# Altium schematic sheet 03_MotorDriver.SchDoc: Motor Driver
size A3; SheetNumber: 4; SheetTotal: 10
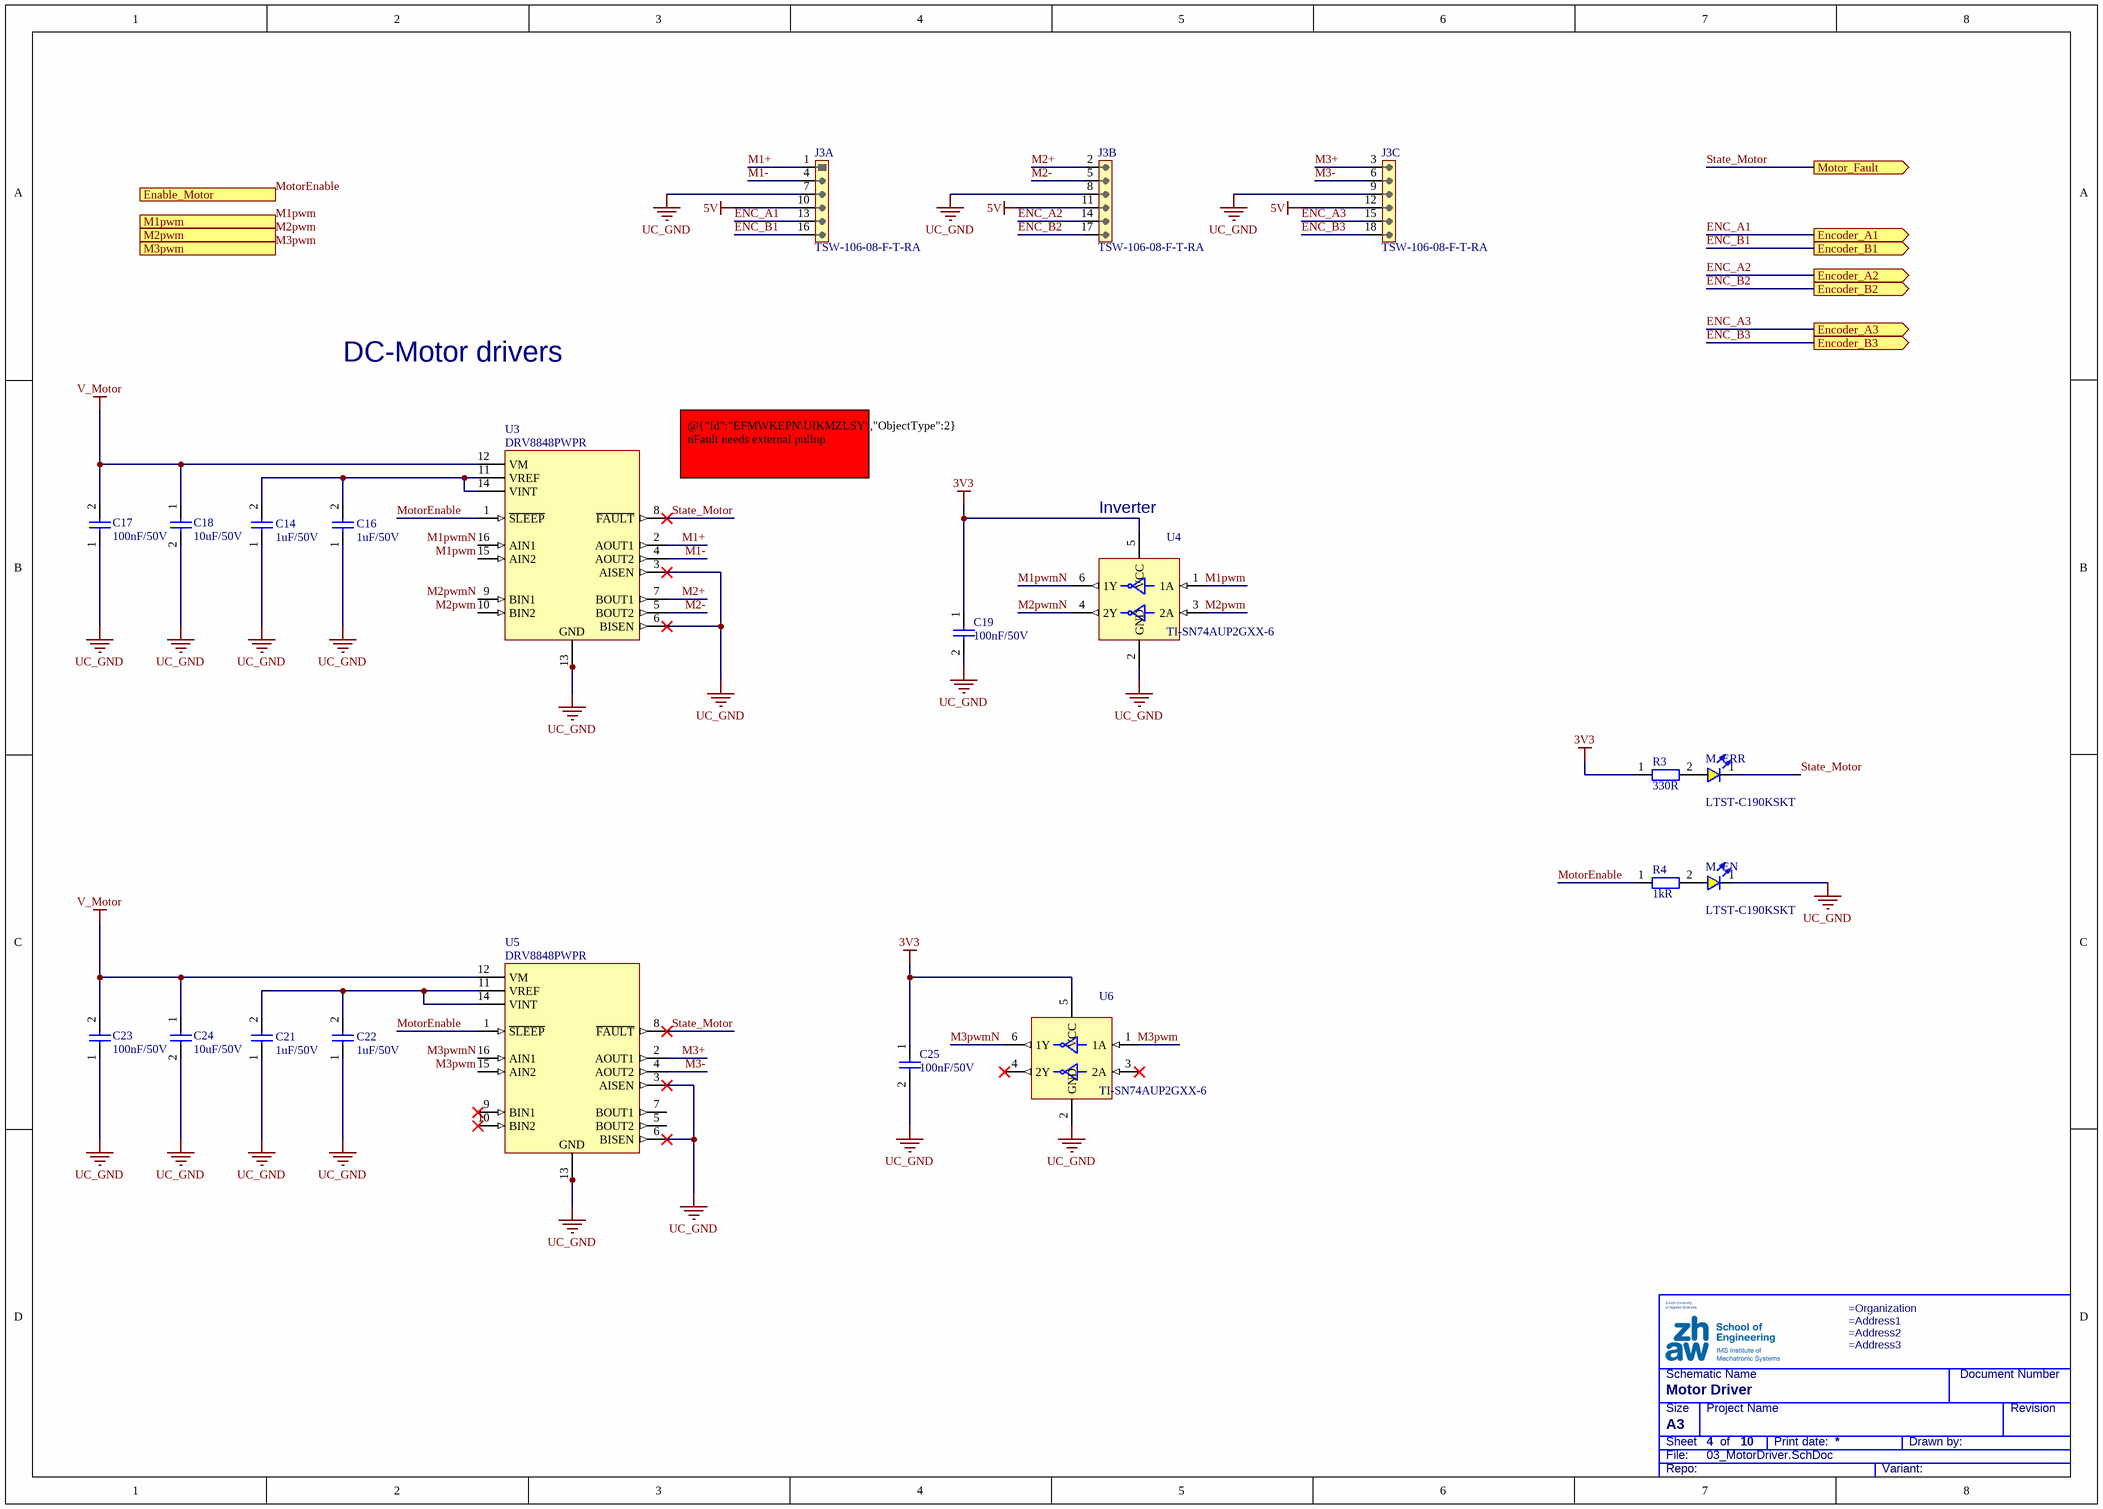
[diagram p0: 03_MotorDriver.SchDoc]

## Parts
C14  1uF/50V  [CAPC1608X09L]
C16  1uF/50V  [CAPC1608X09L]
C17  100nF/50V  [CAPC1005X05L]
C18  10uF/50V  [CAPC3216X12L]
C19  100nF/50V  [CAPC1005X05L]
C21  1uF/50V  [CAPC1608X09L]
C22  1uF/50V  [CAPC1608X09L]
C23  100nF/50V  [CAPC1005X05L]
C24  10uF/50V  [CAPC3216X12L]
C25  100nF/50V  [CAPC1005X05L]
J3  TSW-106-08-F-T-RA  [SAMTEC_TSW-106-08-F-T-RA]  (parts A,B,C of 3)
M._EN  LTST-C190KSKT  [LEDSC160X80X80-2Lye]
M._ERR  LTST-C190KSKT  [LEDSC160X80X80-2Lye]
R3  330R  [RESC1005X04L]
R4  1kR  [RESC1005X04L]
U3  DRV8848PWPR  [TSOP65P640X120-17T277X246L]
U4  TI-SN74AUP2GXX-6  [SOT65P210X110-6L]
U5  DRV8848PWPR  [TSOP65P640X120-17T277X246L]
U6  TI-SN74AUP2GXX-6  [SOT65P210X110-6L]

## Ports
Enable_Motor (in), Encoder_A1 (out), Encoder_A2 (out), Encoder_A3 (out), Encoder_B1 (out), Encoder_B2 (out), Encoder_B3 (out), M1pwm (in), M2pwm (in), M3pwm (in), Motor_Fault (out)

## Nets
3V3: C19.1 C25.1 R3.1 U4.5(VCC) U6.5(VCC)
5V: J3.10 J3.11 J3.12
UC_GND: C14.1 C16.1 C17.1 C18.2 C19.2 C21.1 C22.1 C23.1 C24.2 C25.2 J3.7 J3.8 J3.9 M._EN.1(K) U3.3(AISEN) U3.6(BISEN) U3.13(GND) U3.17(GND) U4.2(GND) U5.3(AISEN) U5.6(BISEN) U5.13(GND) U5.17(GND) U6.2(GND)
V_Motor: C17.2 C18.1 C23.2 C24.1 U3.12(VM) U5.12(VM)
ENC_A1: J3.13 ; port Encoder_A1
ENC_A2: J3.14 ; port Encoder_A2
ENC_A3: J3.15 ; port Encoder_A3
ENC_B1: J3.16 ; port Encoder_B1
ENC_B2: J3.17 ; port Encoder_B2
ENC_B3: J3.18 ; port Encoder_B3
M1+: J3.1 U3.2(AOUT1)
M1-: J3.4 U3.4(AOUT2)
M1pwm: U3.15(AIN2) U4.1(1A) ; port M1pwm
M1pwmN: U3.16(AIN1) U4.6(1Y)
M2+: J3.2 U3.7(BOUT1)
M2-: J3.5 U3.5(BOUT2)
M2pwm: U3.10(BIN2) U4.3(2A) ; port M2pwm
M2pwmN: U3.9(BIN1) U4.4(2Y)
M3+: J3.3 U5.2(AOUT1)
M3-: J3.6 U5.4(AOUT2)
M3pwm: U5.15(AIN2) U6.1(1A) ; port M3pwm
M3pwmN: U5.16(AIN1) U6.6(1Y)
MotorEnable: R4.1 U3.1(~{SLEEP}) U5.1(~{SLEEP}) ; port Enable_Motor
State_Motor: M._ERR.1(K) U3.8(~{FAULT}) U5.8(~{FAULT}) ; port Motor_Fault
NetC14_2: C14.2 C16.2 U3.11(VREF) U3.14(VINT)
NetC21_2: C21.2 C22.2 U5.11(VREF) U5.14(VINT)
NetM._EN_2: M._EN.2(A) R4.2
NetM._ERR_2: M._ERR.2(A) R3.2

Not connected (* = marked no-connect by the designer): U5 5(BOUT2) 7(BOUT1) 9(BIN1)* 10(BIN2)*; U6 3(2A)* 4(2Y)*

## Notes on the sheet
- DC-Motor drivers
- (near U3) @{"Id":"EFMWKEPN\UIKMZLSY","ObjectType":2} nFault needs external pullup
- (near U4) Inverter
- Schematic Name
- Document Number
- File:
- Sheet
- Size
- A3
- Project Name
- of
- Print date:
- Drawn by:
- Revision
- Repo:
- Variant:

## Library data of the parts
C14 C16 C21 C22 = CMP-00006-9: Cap MLCC, 1uF, 50V, X5R, 10%, 0603; Value: 1µF; Case/Package: 0603; Case Code (Metric): 1608; Dielectricum: X5R; Mounting Technology: SMD; Tolerance: 10%; Type: MLCC; Voltage Rating: 50V
C17 C19 C23 C25 = CMP-001-00067-18: Cap MLCC, 100nF, 50V, X7R, 10%, 0402; Value: 100nF; Case/Package: 0402; Case Code (Metric): 1005; Dielectricum: X7R; Mounting Technology: SMD; Tolerance: 10%; Type: MLCC; Voltage Rating: 50V
C18 C24 = CMP-001-00092-17: Cap MLCC, 10uF, 50V, X5R, 10%, 1206; Value: 10µF; Case/Package: 1206; Case Code (Metric): 3216; Dielectricum: X5R; Mounting Technology: SMD; Tolerance: 10%; Type: MLCC; Voltage Rating: 50V
J3 = CMP-00360-4: Header, 3x6Pin, Pitch 2.54mm, Male, Horizontal, THT; Manufacturer: Samtec; Plating: Gold; Mating Length: 5.84mm; Pin Mapping: 3x6; Gender: Male; Mounting Technology: Board; Pins: 18; Insulation Height: 2.54mm; Angle: Horizontal; Pitch Row: 2.54mm; Termination Length: 2.29mm; Pitch: 2.54mm
M._EN M._ERR = CMP-007-00025-12: LED, Yellow, 20mA, 2.0V, 0603; Forward Voltage: 2V; Case/Package: 0603; Color: Yellow; Mounting Technology: SMD; Rated Current: 20mA; Size: L1.6B0.8H0.8
R3 = CMP-009-00132-31: Res, 330R, 1%, 0.063W, 0402; Value: 330; Power: 63mW; Voltage Rating: 50V; Case/Package: 0402; Case Code (Metric): 1005; Mounting Technology: SMD; Tolerance: 1%; Type: Fixed
R4 = CMP-009-00009-32: Res, 1kR, 1%, 0.1W, 0402; Value: 1k; Power: 100mW; Voltage Rating: 50V; Case/Package: 0402; Case Code (Metric): 1005; Mounting Technology: SMD; Tolerance: 1%; Type: Fixed
U3 U5 = CMP-00358-2: Half Bridge, 4 Ch, 4..18V, Power 4..18V, 1A, 4Ap, TSOP-16, L5.1B6.2H1.2; Max Logic Voltage: 18V; Peak Current: 4A; Min Logic Voltage: 4V; Channels: 4; Min Power Voltage: 18V; Mounting Technology: SMD; Max Current: 1A; Max Power Voltage: 18V; Size: L5.1B6.2H1.2; Case/Package: TSOP-16; Function: Half Bridge
U4 U6 = CMP-00362-1: INV, 2 Ch, 1 In/Ch, 0.8..5.5V, SC70-6, L2B2.2H1; Channels: 2; Inputs per Channel: 1; Max Supply Voltage: 3.6V; Min Supply Voltage: 800mV; Case/Package: SC70-6; Function: INV; Mounting Technology: SMD; Size: L2B2.2H1